# EAGLE design MS5803_board (EAGLE 7.1.0)
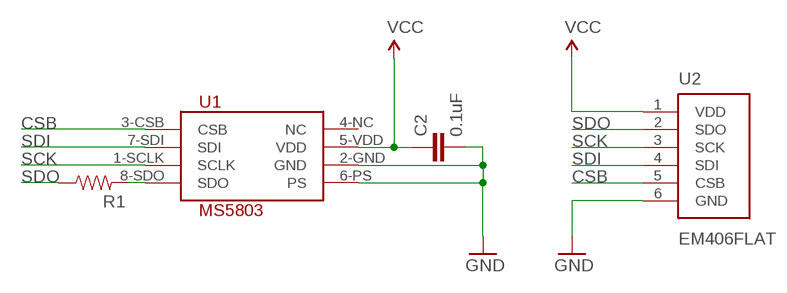
[diagram p0: schematic, sheet 1]

## Parts
C2  0.1uF  CAP0603-CAP  [0603-CAP]
R1  0  RESISTOR0603-RES  [0603-RES]
U1  MS5803  [MS5803]
U2  EM406FLAT  [EM406-FLAT]

## Nets
CSB: U1.3-CSB(CSB) U2.5(CSB)
GND: C2.2 U1.2-GND(GND) U1.6-PS(PS) U2.6(GND)
N$4: R1.2 U1.8-SDO(SDO)
SCK: U1.1-SCLK(SCLK) U2.3(SCK)
SDI: U1.7-SDI(SDI) U2.4(SDI)
SDO: R1.1 U2.2(SDO)
VCC: C2.1 U1.5-VDD(VDD) U2.1(VDD)
Unconnected: U1.4-NC(NC)

## Library data of the parts
C2 = SparkFun-Capacitors:CAP: Capacitor Standard 0603 ceramic capacitor, and 0.1" leaded capacitor.
R1 = SparkFun-Passives:RESISTOR: Resistor Basic schematic elements and footprints for 0603, 1206, and PTH resistors.
U1 = icarus_sensors:MS5803
U2 = icarus_sensors:EM406: EM406 GPS Connector Proven layout and schematic for EM406 connector. Spark Fun Electronics SKU : GPS-00579

## Board
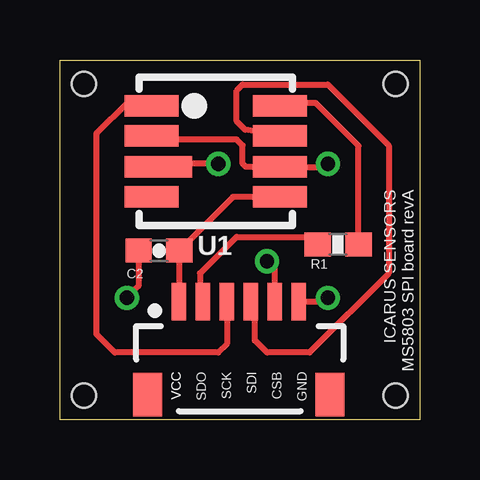
[diagram p1: board, top side]
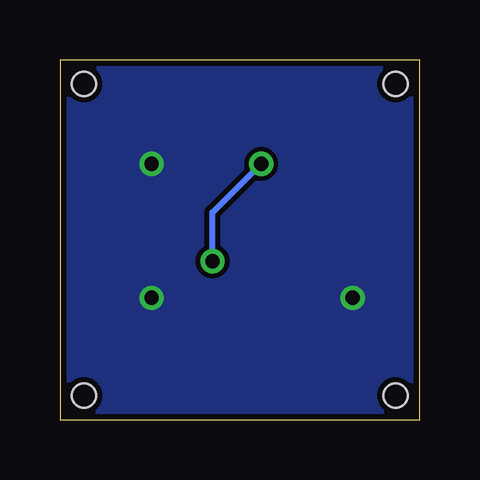
[diagram p2: board, bottom side, seen from below]

Size 15 x 15 mm. Coordinates in mm from the lower left corner, seen from the top.
Outline: 0,0 0,15 15,15 15,0 0,0
Copper layers (1*16): Top 0.035mm / dielectric 1.5mm / Bottom 0.035mm
Design rules "default *": minimum track width 10mil, minimum drill 24mil, track to track 8mil, track to pad 8mil, pad to pad 8mil, via to via 8mil, smd to smd 8mil, copper to edge 10mil, drill to drill 8mil, minimum pad ring 10mil, minimum via ring 8mil, stop-mask expansion 4mil, vias tented up to drill 0mil, thermal gap 10mil
Holes 1 mm at 1,14 14,14 14,1 1,1

### Footprints (pad centres in the part's own frame; a part is rotated, then mirrored left to right if it is on the bottom)
0603-CAP = smd 1.1 x 1: 1 -0.85,0; 2 0.85,0
0603-RES = smd 1.1 x 1: 1 -0.85,0; 2 0.85,0
MS5803 = smd 2.25 x 0.9: 1-SCLK -2.675,1.9; 2-GND -2.675,0.65; 4-NC -2.675,-1.9; 5-VDD 2.675,-1.9; 6-PS 2.675,-0.65; 7-SDI 2.675,0.65; 8-SDO 2.675,1.9 | smd 2.8 x 0.9: 3-CSB -2.4,-0.65
EM406-FLAT = smd 0.6 x 1.55: 1 -2.54,2.92; 2 -1.54,2.92; 3 -0.54,2.92; 4 0.46,2.92; 5 1.46,2.92; 6 2.46,2.92 | smd 1.2 x 1.8: P$1 -3.84,-0.955; P$2 3.76,-0.955

### Placement (x,y rotation side)
C2  4.13,7.05 180 top
R1  11.6,7.3 0 top
U1  6.5,11.19 0 top
U2  7.5,2 0 top

### Tracks (layer width: path | path; a pad name or v marks a point on that pad's centre or on a via)
CSB  (via drill 0.6)
  Top 0.254: v6.6,10.67 4.22,10.67 U1.3-CSB | U2.5 8.96,6.28 v8.64,6.6
  Bottom 0.254: v8.64,6.6 8.64,8.64 v6.6,10.67
GND  (via drill 0.6)
  Top 0.254: U2.6 11.02,4.92 v11.18,5.08 | v11.18,10.67 11.04,10.54 U1.6-PS 7.75,10.54 7.62,10.67 7.62,11.43 7.37,11.68 4.83,11.68 4.57,11.94 3.93,11.94 U1.2-GND | C2.2 3.28,5.57 v2.79,5.08
  pour Bottom: 0.25,14.73 14.73,14.73 14.73,0.25 0.25,0.25
N$4
  Top 0.254: R1.2 12.45,11.43 10.67,13.21 9.3,13.21 U1.8-SDO
SCK
  Top 0.254: U1.1-SCLK 3.69,13.21 2.79,13.21 1.52,11.94 1.52,3.56 2.29,2.79 6.6,2.79 6.96,3.15 U2.3
SDI
  Top 0.254: U1.7-SDI 7.72,12.09 7.37,12.45 7.37,13.72 7.62,13.97 11.18,13.97 13.72,11.43 13.72,6.1 10.41,2.79 8.64,2.79 8.13,3.3 8.13,4.32 | 8.13,4.32 8.13,4.75 | U2.4 7.96,4.49 8.13,4.32
SDO
  Top 0.254: U2.2 5.84,5.04 5.84,6.1 7.37,7.62 10.43,7.62 R1.1
VCC
  Top 0.254: U2.1 4.98,4.92 C2.1 7.22,9.29 U1.5-VDD

### Text on the board
tNames: ICARUS SENSORS / MS5803 SPI board revA